# EAGLE schematic PCB_GW_ESP32_DIO_RS485 (EAGLE 7.7.0)
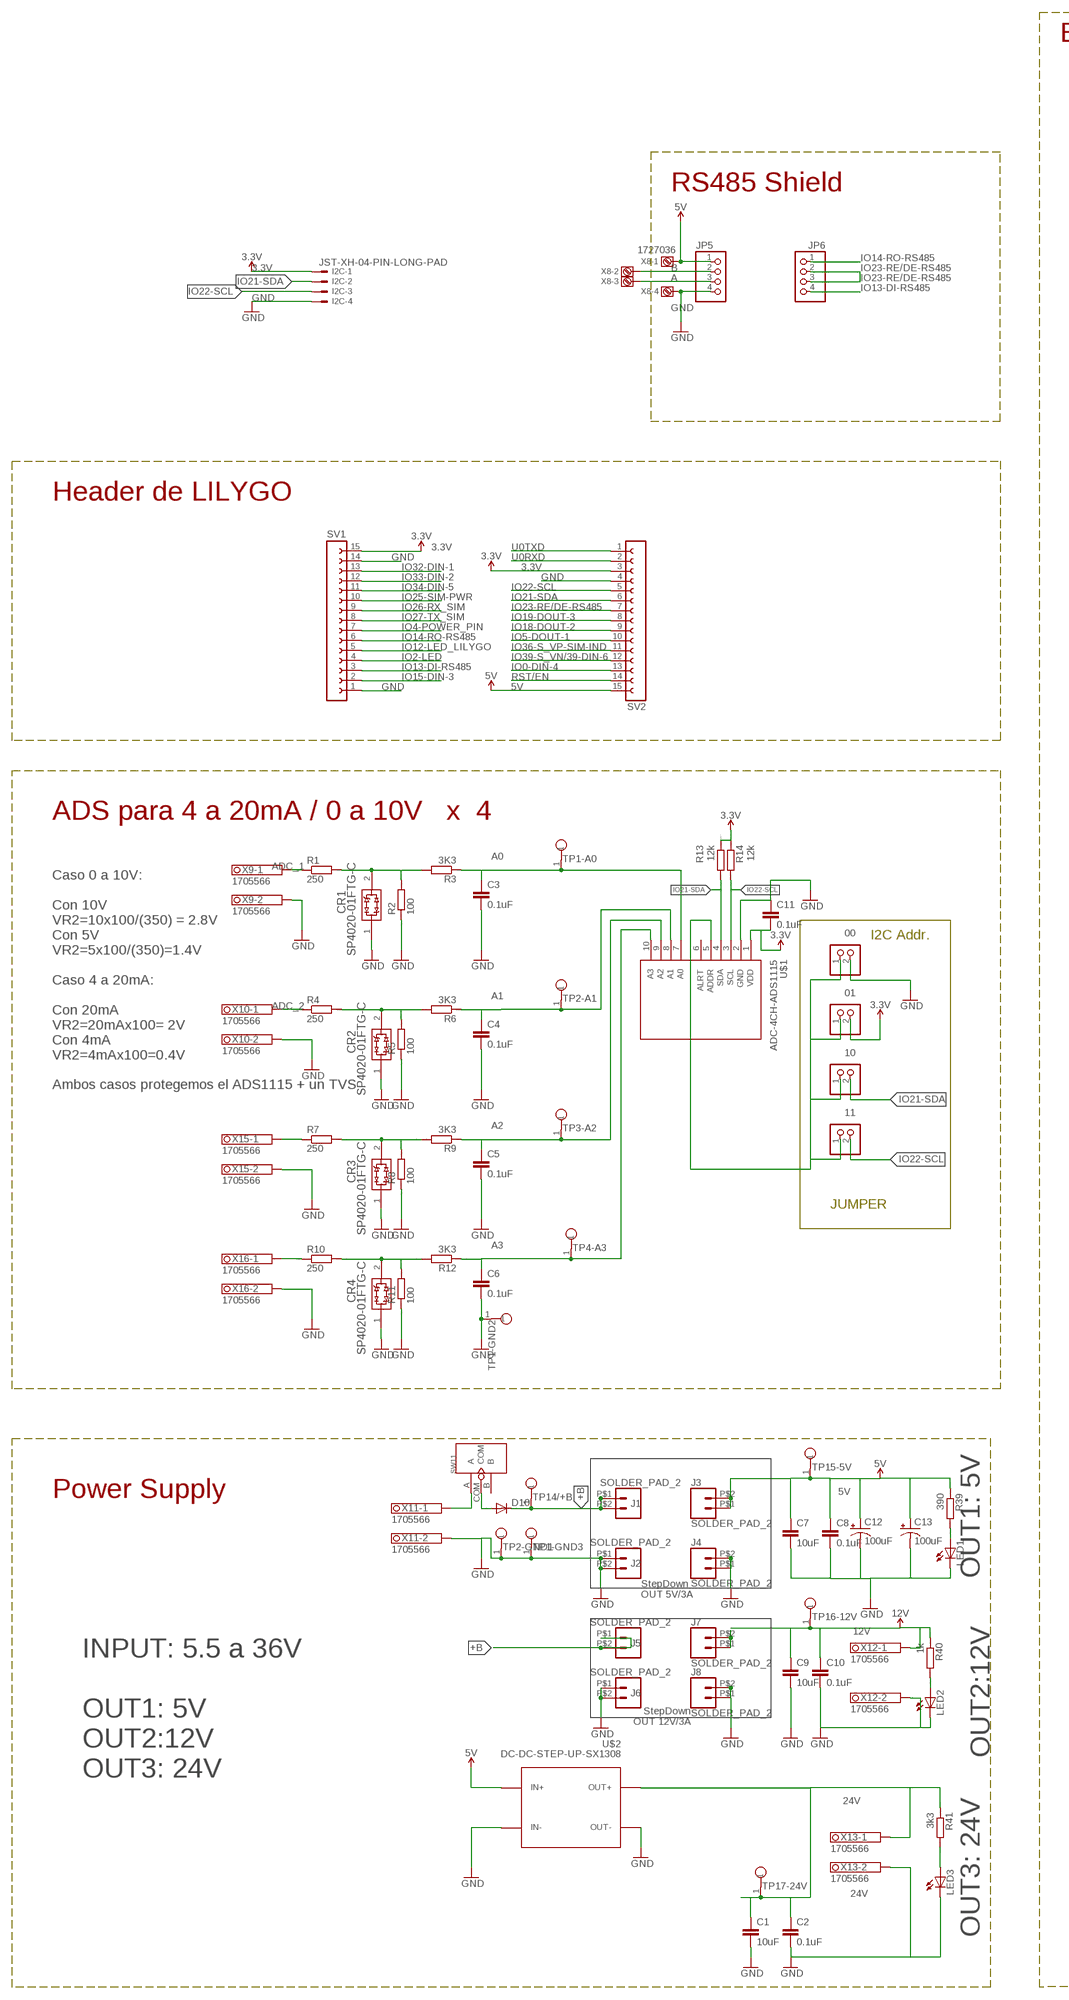
[diagram p0: schematic, sheet 1, part 1 of 2]
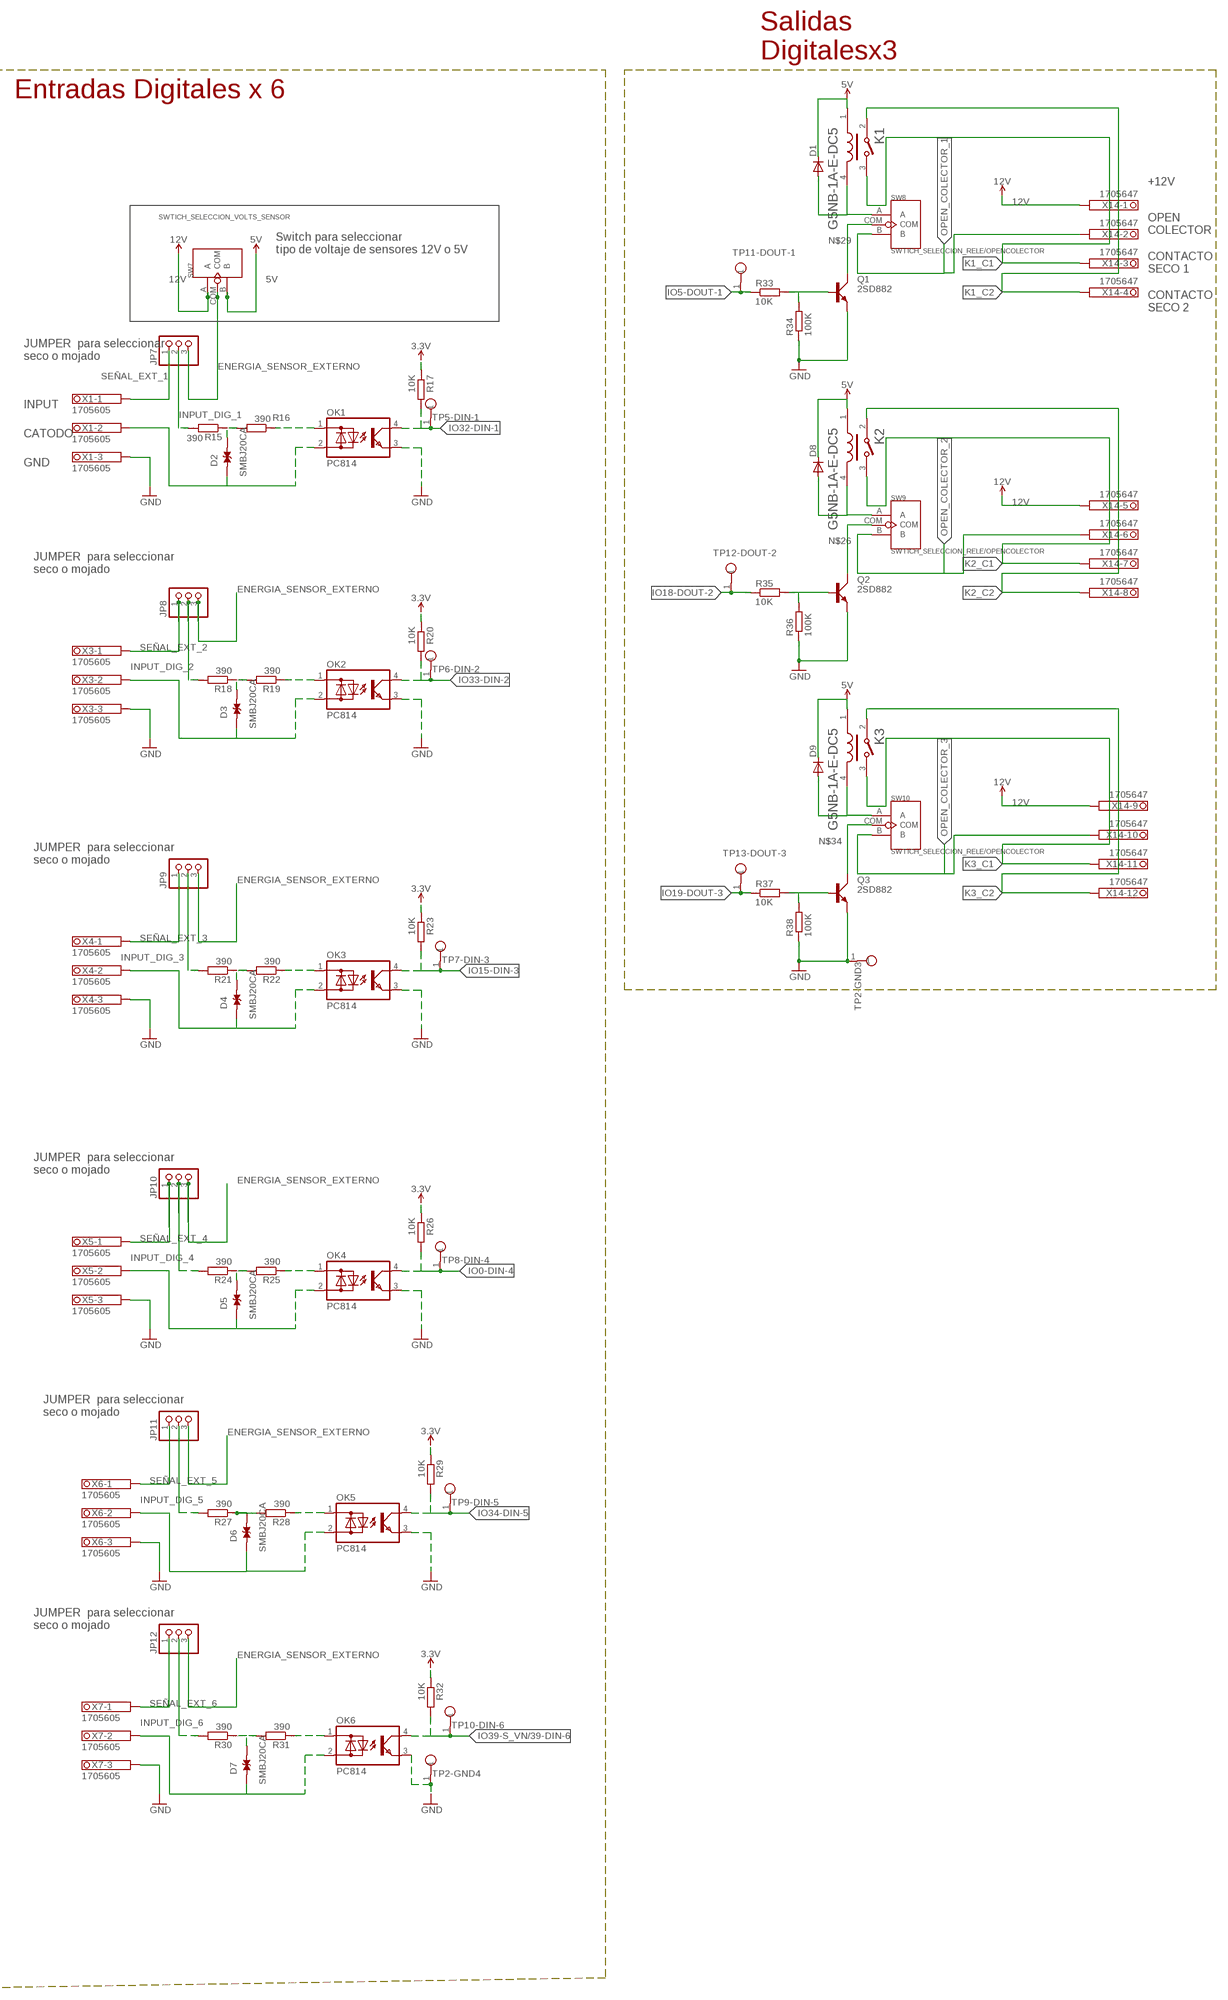
[diagram p1: schematic, sheet 1, part 2 of 2]

## Parts
C1  10uF  10UF-1206-6.3V-20%  [1206]
C2  0.1uF  1.0UF-1206-50V-10%  [1206]
C3  0.1uF  1.0UF-1206-50V-10%  [1206]
C4  0.1uF  1.0UF-1206-50V-10%  [1206]
C5  0.1uF  1.0UF-1206-50V-10%  [1206]
C6  0.1uF  1.0UF-1206-50V-10%  [1206]
C7  10uF  10UF-1206-6.3V-20%  [1206]
C8  0.1uF  1.0UF-1206-50V-10%  [1206]
C9  10uF  10UF-1206-6.3V-20%  [1206]
C10  0.1uF  1.0UF-1206-50V-10%  [1206]
C11  0.1uF  1.0UF-1206-50V-10%  [1206]
C12  100uF  100UF-POLAR-RADIAL-2.5MM-25V-20%  [CPOL-RADIAL-2.5MM-6.5MM]
C13  100uF  100UF-POLAR-25V-20%-SMD(ELEC)  [PANASONIC_D]
CR1  SP4020-01FTG-C  [SOD323_LTF]
CR2  SP4020-01FTG-C  [SOD323_LTF]
CR3  SP4020-01FTG-C  [SOD323_LTF]
CR4  SP4020-01FTG-C  [SOD323_LTF]
D1  DIODE-DO214AC  [DO214AC]
D2  SMBJ20CA  [DIOM4336X265N]
D3  SMBJ20CA  [DIOM4336X265N]
D4  SMBJ20CA  [DIOM4336X265N]
D5  SMBJ20CA  [DIOM4336X265N]
D6  SMBJ20CA  [DIOM4336X265N]
D7  SMBJ20CA  [DIOM4336X265N]
D8  DIODE-DO214AC  [DO214AC]
D9  DIODE-DO214AC  [DO214AC]
D10  DIODE-DO214AC  [DO214AC]
I2C  JST-XH-04-PIN-LONG-PAD  [JST-XH-04-PACKAGE-LONG-PAD]
J1  SOLDER_PAD_2  [SOLDER_PAD_2]
J2  SOLDER_PAD_2  [SOLDER_PAD_2]
J3  SOLDER_PAD_2  [SOLDER_PAD_2]
J4  SOLDER_PAD_2  [SOLDER_PAD_2]
J5  SOLDER_PAD_2  [SOLDER_PAD_2]
J6  SOLDER_PAD_2  [SOLDER_PAD_2]
J7  SOLDER_PAD_2  [SOLDER_PAD_2]
J8  SOLDER_PAD_2  [SOLDER_PAD_2]
JP1  00  PINHD-1X2  [1X02]
JP2  01  PINHD-1X2  [1X02]
JP3  10  PINHD-1X2  [1X02]
JP4  11  PINHD-1X2  [1X02]
JP5  PINHD-1X4  [1X04]
JP6  PINHD-1X4  [1X04]
JP7  PINHD-1X3  [1X03]
JP8  PINHD-1X3  [1X03]
JP9  PINHD-1X3  [1X03]
JP10  PINHD-1X3  [1X03]
JP11  PINHD-1X3  [1X03]
JP12  PINHD-1X3  [1X03]
K1  OMRON_G5NB-1A-E-DC5OMRON_G5NB-1A-E-DC5_0_0  [OMRON_G5NB-1A-E-DC5_0]
K2  OMRON_G5NB-1A-E-DC5OMRON_G5NB-1A-E-DC5_0_0  [OMRON_G5NB-1A-E-DC5_0]
K3  OMRON_G5NB-1A-E-DC5OMRON_G5NB-1A-E-DC5_0_0  [OMRON_G5NB-1A-E-DC5_0]
LED1  LEDCHIPLED_1206  [CHIPLED_1206]
LED2  LEDCHIPLED_1206  [CHIPLED_1206]
LED3  LEDCHIPLED_1206  [CHIPLED_1206]
OK1  PC814  [DIL04]
OK2  PC814  [DIL04]
OK3  PC814  [DIL04]
OK4  PC814  [DIL04]
OK5  PC814  [DIL04]
OK6  PC814  [DIL04]
Q1  2SD882  BD437  [TO126AV]
Q2  2SD882  BD437  [TO126AV]
Q3  2SD882  BD437  [TO126AV]
R1  250  RR1206  [R1206]
R2  100  RR1206  [R1206]
R3  3K3  RR1206  [R1206]
R4  250  RR1206  [R1206]
R5  100  RR1206  [R1206]
R6  3K3  RR1206  [R1206]
R7  250  RR1206  [R1206]
R8  100  RR1206  [R1206]
R9  3K3  RR1206  [R1206]
R10  250  RR1206  [R1206]
R11  100  RR1206  [R1206]
R12  3K3  RR1206  [R1206]
R13  12k  RR1206  [R1206]
R14  12k  RR1206  [R1206]
R15  390  RR1206  [R1206]
R16  390  RR1206  [R1206]
R17  10K  RR1206  [R1206]
R18  390  RR1206  [R1206]
R19  390  RR1206  [R1206]
R20  10K  RR1206  [R1206]
R21  390  RR1206  [R1206]
R22  390  RR1206  [R1206]
R23  10K  RR1206  [R1206]
R24  390  RR1206  [R1206]
R25  390  RR1206  [R1206]
R26  10K  RR1206  [R1206]
R27  390  RR1206  [R1206]
R28  390  RR1206  [R1206]
R29  10K  RR1206  [R1206]
R30  390  RR1206  [R1206]
R31  390  RR1206  [R1206]
R32  10K  RR1206  [R1206]
R33  10K  RR1206  [R1206]
R34  100K  RR1206  [R1206]
R35  10K  RR1206  [R1206]
R36  100K  RR1206  [R1206]
R37  10K  RR1206  [R1206]
R38  100K  RR1206  [R1206]
R39  390  RR1206  [R1206]
R40  1k  RR1206  [R1206]
R41  3k3  RR1206  [R1206]
SV1  FE15-1  [FE15]
SV2  FE15-1  [FE15]
SW7  SWTICH_SELECCION_VOLTS_SENSOR  DIP-TOGGLE-SWITCH-ON-ON(3+2P-8.8X4.6MM)-90D  [SW5-2.0-8.8X4.4X4.7MM-90D]
SW8  SWTICH_SELECCION_RELE/OPENCOLECTOR  DIP-TOGGLE-SWITCH-ON-ON(3+2P-8.8X4.6MM)-90D  [SW5-2.0-8.8X4.4X4.7MM-90D]
SW9  SWTICH_SELECCION_RELE/OPENCOLECTOR  DIP-TOGGLE-SWITCH-ON-ON(3+2P-8.8X4.6MM)-90D  [SW5-2.0-8.8X4.4X4.7MM-90D]
SW10  SWTICH_SELECCION_RELE/OPENCOLECTOR  DIP-TOGGLE-SWITCH-ON-ON(3+2P-8.8X4.6MM)-90D  [SW5-2.0-8.8X4.4X4.7MM-90D]
SW11  DIP-TOGGLE-SWITCH-ON-ON(3+2P-8.8X4.6MM)-90D  [SW5-2.0-8.8X4.4X4.7MM-90D]
TP1-A0  TESTPOINT  [TESTPOINT]
TP1-GND2  TESTPOINT  [TESTPOINT]
TP1-GND3  TESTPOINT  [TESTPOINT]
TP2-A1  TESTPOINT  [TESTPOINT]
TP2-GND1  TESTPOINT  [TESTPOINT]
TP2-GND3  TESTPOINT  [TESTPOINT]
TP2-GND4  TESTPOINT  [TESTPOINT]
TP3-A2  TESTPOINT  [TESTPOINT]
TP4-A3  TESTPOINT  [TESTPOINT]
TP5-DIN-1  TESTPOINT  [TESTPOINT]
TP6-DIN-2  TESTPOINT  [TESTPOINT]
TP7-DIN-3  TESTPOINT  [TESTPOINT]
TP8-DIN-4  TESTPOINT  [TESTPOINT]
TP9-DIN-5  TESTPOINT  [TESTPOINT]
TP10-DIN-6  TESTPOINT  [TESTPOINT]
TP11-DOUT-1  TESTPOINT  [TESTPOINT]
TP12-DOUT-2  TESTPOINT  [TESTPOINT]
TP13-DOUT-3  TESTPOINT  [TESTPOINT]
TP14/+B  TESTPOINT  [TESTPOINT]
TP15-5V  TESTPOINT  [TESTPOINT]
TP16-12V  TESTPOINT  [TESTPOINT]
TP17-24V  TESTPOINT  [TESTPOINT]
U$1  ADC-4CH-ADS1115  [ADC-4CH-ADS1115]
U$2  DC-DC-STEP-UP-SX1308  [DC-DC-STEP-UP-SX1308]
X1  1705605  [1705605]
X3  1705605  [1705605]
X4  1705605  [1705605]
X5  1705605  [1705605]
X6  1705605  [1705605]
X7  1705605  [1705605]
X8  1727036  [1727036]
X9  1705566  [1705566]
X10  1705566  [1705566]
X11  1705566  [1705566]
X12  1705566  [1705566]
X13  1705566  [1705566]
X14  1705647  [1705647]
X15  1705566  [1705566]
X16  1705566  [1705566]

## Nets
3.3V: C11.2 I2C.1 JP2.2 R13.1 R14.1 R17.1 R20.1 R23.1 R26.1 R29.1 R32.1 SV1.15 SV2.3 U$1.1(VDD)
5V: C7.1 C8.1 C12.1(+) C13.+ D1.C D8.C D9.C J3.P$1 J3.P$2 JP5.1 K1.1 K2.1 K3.1 R39.1 SV2.15 SW7.B TP15-5V.1 U$2.IN+ X8.1
12V: C9.1 C10.1 J7.P$1 J7.P$2 R40.1 SW7.A TP16-12V.1 X12.1.1 X12.1.2 X14.1.1 X14.1.2 X14.5.1 X14.5.2 X14.9.1 X14.9.2
24V: C1.1 C2.1 R41.1 TP17-24V.1 U$2.OUT+ X13.1.1 X13.1.2
+B: D10.C J1.P$1 J1.P$2 J5.P$1 J5.P$2 TP14/+B.1
A: JP5.3 X8.3
A0: C3.1 R3.1 TP1-A0.1 U$1.7(A0)
A1: C4.1 R6.1 TP2-A1.1 U$1.8(A1)
A2: C5.1 R9.1 TP3-A2.1 U$1.9(A2)
A3: C6.1 R12.1 TP4-A3.1 U$1.10(A3)
ADC_1: R1.1 X9.1.1 X9.1.2
ADC_2: R4.1 X10.1.1 X10.1.2
ADC_3: R7.1 X15.1.1 X15.1.2
ADC_4: R10.1 X16.1.1 X16.1.2
B: JP5.2 X8.2
ENERGIA_SENSOR_EXTERNO: JP7.3 JP8.3 JP9.3 JP10.3 JP11.3 JP12.3 SW7.COM
GND: C1.2 C2.2 C3.2 C4.2 C5.2 C6.2 C7.2 C8.2 C9.2 C10.2 C11.1 C12.2(-) C13.- CR1.1 CR2.1 CR3.1 CR4.1 I2C.4 J2.P$1 J2.P$2 J4.P$1 J4.P$2 J6.P$1 J6.P$2 J8.P$1 J8.P$2 JP1.2 JP5.4 LED1.C LED2.C LED3.C OK1.3(E) OK2.3(E) OK3.3(E) OK4.3(E) OK5.3(E) OK6.3(E) Q1.E Q2.E Q3.E R2.1 R5.1 R8.1 R11.1 R34.1 R36.1 R38.1 SV1.1 SV1.14 SV2.4 TP1-GND2.1 TP1-GND3.1 TP2-GND1.1 TP2-GND3.1 TP2-GND4.1 U$1.2(GND) U$2.IN- U$2.OUT- X1.3.1 X1.3.2 X3.3.1 X3.3.2 X4.3.1 X4.3.2 X5.3.1 X5.3.2 X6.3.1 X6.3.2 X7.3.1 X7.3.2 X8.4 X9.2.1 X9.2.2 X10.2.1 X10.2.2 X11.2.1 X11.2.2 X12.2.1 X12.2.2 X13.2.1 X13.2.2 X15.2.1 X15.2.2 X16.2.1 X16.2.2
INPUT_DIG_1: JP7.2 R15.2
INPUT_DIG_2: JP8.2 R18.2
INPUT_DIG_3: JP9.2 R21.2
INPUT_DIG_4: JP10.2 R24.2
INPUT_DIG_5: JP11.2 R27.2
INPUT_DIG_6: JP12.2 R30.2
IO0-DIN-4: OK4.4(C) R26.2 SV2.13 TP8-DIN-4.1
IO2-LED: SV1.4
IO4-POWER_PIN: SV1.7
IO5-DOUT-1: R33.1 SV2.10 TP11-DOUT-1.1
IO12-LED_LILYGO: SV1.5
IO13-DI-RS485: JP6.4 SV1.3
IO14-RO-RS485: JP6.1 SV1.6
IO15-DIN-3: OK3.4(C) R23.2 SV1.2 TP7-DIN-3.1
IO18-DOUT-2: R35.1 SV2.9 TP12-DOUT-2.1
IO19-DOUT-3: R37.1 SV2.8 TP13-DOUT-3.1
IO21-SDA: I2C.2 JP3.2 R13.2 SV2.6 U$1.4(SDA)
IO22-SCL: I2C.3 JP4.2 R14.2 SV2.5 U$1.3(SCL)
IO23-RE/DE-RS485: JP6.2 JP6.3 SV2.7
IO25-SIM-PWR: SV1.10
IO26-RX_SIM: SV1.9
IO27-TX_SIM: SV1.8
IO32-DIN-1: OK1.4(C) R17.2 SV1.13 TP5-DIN-1.1
IO33-DIN-2: OK2.4(C) R20.2 SV1.12 TP6-DIN-2.1
IO34-DIN-5: OK5.4(C) R29.2 SV1.11 TP9-DIN-5.1
IO36-S_VP-SIM-IND: SV2.11
IO39-S_VN/39-DIN-6: OK6.4(C) R32.2 SV2.12 TP10-DIN-6.1
K1_C1: K1.3 X14.3.1 X14.3.2
K1_C2: K1.2 X14.4.1 X14.4.2
K2_C1: K2.3 X14.7.1 X14.7.2
K2_C2: K2.2 X14.8.1 X14.8.2
K3_C1: K3.3 X14.11.1 X14.11.2
K3_C2: K3.2 X14.12.1 X14.12.2
N$1: LED1.A R39.2
N$2: CR2.2 R4.2 R5.2 R6.2
N$3: CR1.2 R1.2 R2.2 R3.2
N$4: CR3.2 R7.2 R8.2 R9.2
N$5: CR4.2 R10.2 R11.2 R12.2
N$6: JP1.1 JP2.1 JP3.1 JP4.1 U$1.5(ADDR)
N$7: OK1.1(AC1) R16.1
N$8: D2.2 R15.1 R16.2
N$10: OK2.1(AC1) R19.1
N$11: D3.2 R18.1 R19.2
N$15: OK3.1(AC1) R22.1
N$16: D4.2 R21.1 R22.2
N$19: OK4.1(AC1) R25.1
N$20: D5.2 R24.1 R25.2
N$21: Q1.B R33.2 R34.2
N$23: OK5.1(AC1) R28.1
N$24: D6.2 R27.1 R28.2
N$25: Q2.B R35.2 R36.2
N$26: Q2.C SW9.COM
N$27: OK6.1(AC1) R31.1
N$28: D7.2 R30.1 R31.2
N$29: Q1.C SW8.COM
N$30: D1.A K1.4 SW8.A
N$31: D8.A K2.4 SW9.A
N$32: D10.A SW11.COM
N$33: Q3.B R37.2 R38.2
N$34: Q3.C SW10.COM
N$35: D9.A K3.4 SW10.A
N$36: LED3.A R41.2
N$38: LED2.A R40.2
OPEN_COLECTOR_1: SW8.B X14.2.1 X14.2.2
OPEN_COLECTOR_2: SW9.B X14.6.1 X14.6.2
OPEN_COLECTOR_3: SW10.B X14.10.1 X14.10.2
POWER_IN: SW11.A X11.1.1 X11.1.2
RST/EN: SV2.14
SEÑAL_EXT_1: JP7.1 X1.1.1 X1.1.2
SEÑAL_EXT_2: JP8.1 X3.1.1 X3.1.2
SEÑAL_EXT_3: JP9.1 X4.1.1 X4.1.2
SEÑAL_EXT_4: JP10.1 X5.1.1 X5.1.2
SEÑAL_EXT_5: JP11.1 X6.1.1 X6.1.2
SEÑAL_EXT_6: JP12.1 X7.1.1 X7.1.2
SPDT1: D2.1 OK1.2(AC2) X1.2.1 X1.2.2
SPDT2: D3.1 OK2.2(AC2) X3.2.1 X3.2.2
SPDT3: D4.1 OK3.2(AC2) X4.2.1 X4.2.2
SPDT4: D5.1 OK4.2(AC2) X5.2.1 X5.2.2
SPDT5: D6.1 OK5.2(AC2) X6.2.1 X6.2.2
SPDT6: D7.1 OK6.2(AC2) X7.2.1 X7.2.2
U0RXD: SV2.2
U0TXD: SV2.1
Unconnected: SW11.B U$1.6(ALRT)

## Notes on the sheet
- GATEWAY con LILYGO
  (Claudio Salgado Purcell, Purcell Cerliani Electrónica y Tecnologias SpA)
  
  RS485
  6 DI
  3 DO  opcional con switch open colector/relé
  4 ADC
  
  Volts de servicio o auxiliar: 12V y 24V
- Salidas  
  Digitalesx3
- Entradas Digitales x 6
- +12V
- RS485 Shield
- OPEN 
  COLECTOR
- Switch para seleccionar
  tipo de voltaje de sensores 12V o 5V
- CONTACTO
  SECO 1
- CONTACTO
  SECO 2
- JUMPER  para seleccionar
  seco o mojado
- INPUT
- CATODO
- GND
- Header de LILYGO
- JUMPER  para seleccionar
  seco o mojado
- ADS para 4 a 20mA / 0 a 10V   x  4
- JUMPER  para seleccionar
  seco o mojado
- I2C Addr.
- Caso 0 a 10V:
  
  Con 10V
  VR2=10x100/(350) = 2.8V
  Con 5V
  VR2=5x100/(350)=1.4V
  
  Caso 4 a 20mA:
  
  Con 20mA
  VR2=20mAx100= 2V
  Con 4mA
  VR2=4mAx100=0.4V
  
  Ambos casos protegemos el ADS1115 + un TVS
- JUMPER  para seleccionar
  seco o mojado
- JUMPER
- JUMPER  para seleccionar
  seco o mojado
- Power Supply
- OUT1: 5V
- StepDown
  OUT 5V/3A
- JUMPER  para seleccionar
  seco o mojado
- StepDown
  OUT 12V/3A
- OUT2:12V
- INPUT: 5.5 a 36V
  
  OUT1: 5V
  OUT2:12V
  OUT3: 24V
- OUT3: 24V

## Library data of the parts
C1 C7 C9 = SparkFun-Capacitors:10UF: 10.0µF ceramic capacitors A capacitor is a passive two-terminal electrical component used to store electrical energy temporarily in an electric field.; PROD_ID: CAP-10057
C2-C6 C8 C10 C11 = SparkFun-Capacitors:1.0UF: 1µF ceramic capacitors A capacitor is a passive two-terminal electrical component used to store electrical energy temporarily in an electric field.; PROD_ID: CAP-09822; VALUE: 1.0uF
C12 = SparkFun-Capacitors:100UF-POLAR: 100µF polarized capacitors A capacitor is a passive two-terminal electrical component used to store electrical energy temporarily in an electric field.; PROD_ID: CAP-08439
C13 = SparkFun-Capacitors:100UF-POLAR: 100µF polarized capacitors A capacitor is a passive two-terminal electrical component used to store electrical energy temporarily in an electric field.; PN: EDH107M025A9HAA; PROD_ID: CAP-17222
CR1-CR4 = SP4020-01FTG-C:SP4020-01FTG-C; COPYRIGHT: Copyright (C) 2023 Ultra Librarian. All rights reserved.; MANUFACTURER_PART_NUMBER: SP4020-01FTG-C; MFR_NAME: Littelfuse Inc
D1 D8-D10 = diode:DIODE-: DIODE
D2-D7 = SMBJ20CA:SMBJ20CA: Check availability <https://pricing.snapeda.com/parts/SMBJ20CA/Taiwan%20Semiconductor/view-part?ref=eda>; AVAILABILITY: In Stock; DESCRIPTION: 600W, 23.4V, 5%, Bidirectional, TVS; MF: Taiwan Semiconductor; MP: SMBJ20CA; PACKAGE: SMB Taiwan Semiconductor; PRICE: None; PURCHASE-URL: https://pricing.snapeda.com/search/part/SMBJ20CA/?ref=eda
I2C = Rembrandt Electronics - JST XH Connectors v1-0:JST-XH-04-PIN: JST XH Connector 2 Pin Wire to board connector. Pitch: 2,54 mm, (0.100") Number of pins: 4 Created by Rembrandt Electronics www.rembrandtelectronics.com
J1-J8 = SparkFun-Connectors:SOLDER_PAD_2: Solder Pad for LuMini Rings
JP1-JP4 = pinhead:PINHD-1X2: PIN HEADER
JP5 JP6 = pinhead:PINHD-1X4: PIN HEADER
JP7-JP12 = pinhead:PINHD-1X3: PIN HEADER
K1-K3 = Omron - G5NB-1A-E-DC5:OMRON_G5NB-1A-E-DC5: General Purpose Relay SPST-NO (1 Form A) 5VDC Coil Through Hole; AMBIENT_TEMPERATURE_RANGE_HIGH: +85°C; AMBIENT_TEMPERATURE_RANGE_LOW: -40°C; AUTOMOTIVE: No; CENTROID_NOT_SPECIFIED: No; COIL_CURRENT: 40mA; COIL_POWER: 200mW; COIL_RESISTANCE: 125Ω; COIL_TYPE: Non-Latching; COIL_VOLTAGE: 5V; CURRENT_RATING: 5A; DATASHEET: https://omronfs.omron.com/en_US/ecb/products/pdf/en-g5nb.pdf; DEVICE_CLASS_L1: Electromechanical; DEVICE_CLASS_L2: Relays; DEVICE_CLASS_L3: Power Relays; DIGIKEY_DESCRIPTION: RELAY GENERAL PURPOSE SPST 5A 5V; DIGIKEY_PART_NUMBER: Z2771-ND; FOOTPRINT_VARIANT_NAME_0: Recommended_Land_Pattern; HEIGHT: 15.3mm; LEAD_FREE: Yes; MF: Omron; MFG_PACKAGE_IDENT: 0; MFG_PACKAGE_IDENT_DATE: 0; MFG_PACKAGE_IDENT_REV: 0; MOUSER_DESCRIPTION: Power Relay 5VDC 3DC/5AAC SPST-NO( (20.5mm 7.2mm 15.3mm)) THT; MOUSER_PART_NUMBER: 653-G5NB-1A-E-DC5; MPN: G5NB-1A-E-DC5; NUMBER_OF_CONTACTS: 1; PACKAGE: PTH_RELAY_20MM4_7MM0; PREFIX: K; ROHS: Yes; SWITCHING_CURRENT: 5A; TEMPERATURE_RANGE_HIGH: +85°C; TEMPERATURE_RANGE_LOW: -40°C; THROW_CONFIGURATION: SPST-NO; VERIFICATION_VERSION: 0.0.0.3
LED1-LED3 = led:LED: LED OSRAM: - CHIPLED LG R971, LG N971, LY N971, LG Q971, LY Q971, LO R971, LY R971 LH N974, LH R974 LS Q976, LO Q976, LY Q976 LO Q996 - Hyper CHIPLED LW Q18S LB Q993, LB Q99A, LB R99A - SideLED LS A670, LO A670, LY A670, LG A670, LP A670 LB A673, LV A673, LT A673, LW A673 LH A674 LY A675 LS A676, LA A676, LO A676, LY A676, LW A676 LS A679, LY A679, LG A679 - Hyper Micro SIDELED® LS Y876, LA Y876, LO Y876, LY Y876 LT Y87S - SmartLED LW L88C, LW L88S LB L89C, LB L89S, LG L890 LS L89K, LO L89K, LY L89K LS L896, LA L896, LO L896, LY L896 - TOPLED LS T670, LO T670, LY T670, LG T670, LP T670 LSG T670, LSP T670, LSY T670, LOP T670, LYG T670 LG T671, LOG T671, LSG T671 LB T673, LV T673, LT T673, LW T673 LH T674 LS T676, LA T676, LO T676, LY T676, LB T676, LH T676, LSB T676, LW T676 LB T67C, LV T67C, LT T67C, LS T67K, LO T67K, LY T67K, LW E67C LS E67B, LA E67B, LO E67B, LY E67B, LB E67C, LV E67C, LT E67C LW T67C LS T679, LY T679, LG T679 LS T770, LO T770, LY T770, LG T770, LP T770 LB T773, LV T773, LT T773, LW T773 LH T774 LS E675, LA E675, LY E675, LS T675 LS T776, LA T776, LO T776, LY T776, LB T776 LHGB T686 LT T68C, LB T68C - Hyper Mini TOPLED® LB M676 - Mini TOPLED Santana® LG M470 LS M47K, LO M47K, LY M47K Source: http://www.osram.convergy.de LUXEON: - LUMILED® LXK2-PW12-R00, LXK2-PW12-S00, LXK2-PW14-U00, LXK2-PW14-V00 LXK2-PM12-R00, LXK2-PM12-S00, LXK2-PM14-U00 LXK2-PE12-Q00, LXK2-PE12-R00, LXK2-PE12-S00, LXK2-PE14-T00, LXK2-PE14-U00 LXK2-PB12-K00, LXK2-PB12-L00, LXK2-PB12-M00, LXK2-PB14-N00, LXK2-PB14-P00, LXK2-PB14-Q00 LXK2-PR12-L00, LXK2-PR12-M00, LXK2-PR14-Q00, LXK2-PR14-R00 LXK2-PD12-Q00, LXK2-PD12-R00, LXK2-PD12-S00 LXK2-PH12-R00, LXK2-PH12-S00 LXK2-PL12-P00, LXK2-PL12-Q00, LXK2-PL12-R00 Source: www.luxeon.com KINGBRIGHT: KA-3528ASYC Source: www.kingbright.com
OK1-OK6 = optocoupler:PC814: SHARP OPTO COUPLER; OC_FARNELL: 9707662; OC_NEWARK: unknown
Q1-Q3 = transistor-power:BD437: NPN TRANSISTOR
R1-R41 = eagle-ltspice:R: RESISTOR, European symbol; SPICEMODEL: NONE; SPICEPREFIX: R
SV1 SV2 = con-lsta:FE15-1: FEMALE HEADER; OC_FARNELL: unknown; OC_NEWARK: unknown
SW7-SW11 = Seeed-Switch-2016:DIP-TOGGLE-SWITCH-ON-ON(3+2P-8.8X4.6MM)-90D: 311030008; MPN: 3P-2.0-90D3P-2.0-90D-REINFORCE
TP1-A0 TP1-GND2 TP1-GND3 TP2-A1 TP2-GND1 TP2-GND3 TP2-GND4 TP3-A2 TP4-A3 TP5-DIN-1 TP6-DIN-2 TP7-DIN-3 TP8-DIN-4 TP9-DIN-5 TP10-DIN-6 TP11-DOUT-1 TP12-DOUT-2 TP13-DOUT-3 TP14/+B TP15-5V TP16-12V TP17-24V = RHD2000_eval_board:TESTPOINT: PCB Test Point
U$1 = cargador microusb-modules lib:ADC-4CH-ADS1115: 4 Channel 16-Bit Analog-to-Digital Converter based on ADS1115 chip Arduino ADS1115 Getting Started Tutorial is available here: http://henrysbench.capnfatz.com/henrys-bench/arduino-voltage-measurements/arduino-ads1115-module-getting-started-tutorial/ ADS1115 datasheet is available here: http://www.ti.com/lit/ds/symlink/ads1115.pdf Click here to find device on ebay.com <http://www.ebay.com/sch/ads1115+module>
U$2 = SX1308:DC-DC-STEP-UP-SX1308: DC/DC Step-Up Regulator based on SX1308 chip SX1308 datasheet available here: https://www.olimex.com/Products/Breadboarding/BB-PWR-3608/resources/MT3608.pdf Click here to find device on ebay.com <http://www.ebay.com/sch/mt3608+module>
X1 X3-X7 = con-phoenix-3.81MODIFICADO:1705605: MKDSD 1,5/10-3,81 Printklemme Nennstrom: 8 A Bemessungsspannung: 200 V Raster: 3,81 mm Polzahl: 12 Montageart: Löten Anschlussart: Schraubanschluss Anschlussrichtung vom Leiter zur Platine: 0° Source: http://eshop.phoenixcontact.com .. 1705605.pdf; OC_FARNELL: unknown; OC_NEWARK: unknown
X8 = con-phoenix-3.81MODIFICADO:1727036: MKDS 1/4-3,81 Source: http://eshop.phoenixcontact.de; MF: FARNELL; MPN: 1727036; OC_FARNELL: 3704592; OC_NEWARK: 71C4114
X9-X13 X15 X16 = con-phoenix-3.81MODIFICADO:1705566: MKDSD 1,5/ 4-3,81 Printklemme Nennstrom: 8 A Bemessungsspannung: 200 V Raster: 3,81 mm Polzahl: 4 Montageart: Löten Anschlussart: Schraubanschluss Anschlussrichtung vom Leiter zur Platine: 0° Source: http://eshop.phoenixcontact.com .. 1705566.pdf; OC_FARNELL: unknown; OC_NEWARK: unknown
X14 = con-phoenix-3.81MODIFICADO:1705647: MKDSD 1,5/12-3,81 Printklemme Nennstrom: 8 A Bemessungsspannung: 200 V Raster: 3,81 mm Polzahl: 12 Montageart: Löten Anschlussart: Schraubanschluss Anschlussrichtung vom Leiter zur Platine: 0° Source: http://eshop.phoenixcontact.com .. 1705647.pdf; OC_FARNELL: unknown; OC_NEWARK: unknown